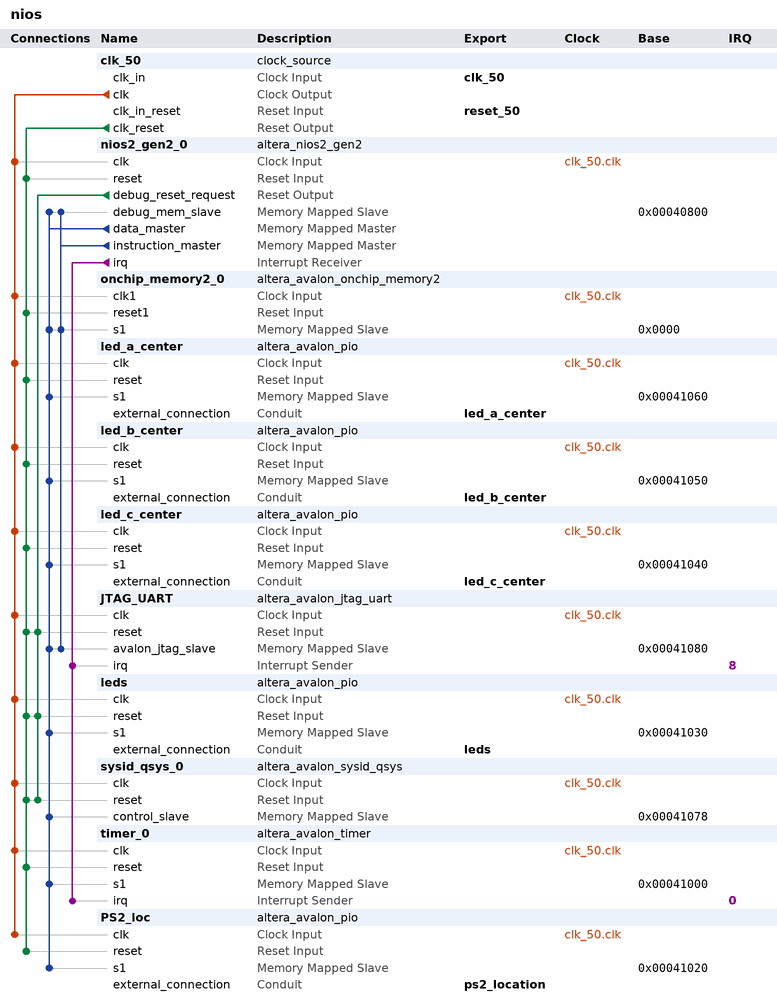
[diagram p0: system contents]
# Platform Designer (Qsys) system nios, Cyclone IV E EP4CE115F29C7
# Parameters at their usual value, and those the tool derives, are not listed.
package require -exact qsys 16.1
create_system nios
set_project_property DEVICE_FAMILY {Cyclone IV E}
set_project_property DEVICE EP4CE115F29C7

add_instance clk_50 clock_source 16.1
set_instance_parameter_value clk_50 clockFrequency 50000000

add_instance nios2_gen2_0 altera_nios2_gen2 16.1
set_instance_parameter_value nios2_gen2_0 dcache_size 2048
set_instance_parameter_value nios2_gen2_0 exceptionSlave onchip_memory2_0.s1
set_instance_parameter_value nios2_gen2_0 icache_size 4096
set_instance_parameter_value nios2_gen2_0 impl Tiny
set_instance_parameter_value nios2_gen2_0 resetSlave onchip_memory2_0.s1

add_instance onchip_memory2_0 altera_avalon_onchip_memory2 16.1
set_instance_parameter_value onchip_memory2_0 blockType M9K
set_instance_parameter_value onchip_memory2_0 dataWidth 32
set_instance_parameter_value onchip_memory2_0 dualPort false
set_instance_parameter_value onchip_memory2_0 initMemContent false
set_instance_parameter_value onchip_memory2_0 initializationFileName onchip_mem.hex
set_instance_parameter_value onchip_memory2_0 memorySize 200000

add_instance led_a_center altera_avalon_pio 16.1
set_instance_parameter_value led_a_center direction Input
set_instance_parameter_value led_a_center width 17

add_instance led_b_center altera_avalon_pio 16.1
set_instance_parameter_value led_b_center direction Input
set_instance_parameter_value led_b_center width 17

add_instance led_c_center altera_avalon_pio 16.1
set_instance_parameter_value led_c_center direction Input
set_instance_parameter_value led_c_center width 17

add_instance JTAG_UART altera_avalon_jtag_uart 16.1
set_instance_parameter_value JTAG_UART simInteractiveOptions NO_INTERACTIVE_WINDOWS

add_instance leds altera_avalon_pio 16.1
set_instance_parameter_value leds direction Output
set_instance_parameter_value leds width 17

add_instance sysid_qsys_0 altera_avalon_sysid_qsys 16.1
set_instance_parameter_value sysid_qsys_0 id 0

add_instance timer_0 altera_avalon_timer 16.1
set_instance_parameter_value timer_0 alwaysRun true
set_instance_parameter_value timer_0 fixedPeriod true
set_instance_parameter_value timer_0 period 10
set_instance_parameter_value timer_0 periodUnits MSEC
set_instance_parameter_value timer_0 snapshot false

add_instance PS2_loc altera_avalon_pio 16.1
set_instance_parameter_value PS2_loc direction Output
set_instance_parameter_value PS2_loc width 5

# connections
add_connection clk_50.clk JTAG_UART.clk clock
add_connection clk_50.clk led_a_center.clk clock
add_connection clk_50.clk led_b_center.clk clock
add_connection clk_50.clk led_c_center.clk clock
add_connection clk_50.clk leds.clk clock
add_connection clk_50.clk nios2_gen2_0.clk clock
add_connection clk_50.clk onchip_memory2_0.clk1 clock
add_connection clk_50.clk PS2_loc.clk clock
add_connection clk_50.clk sysid_qsys_0.clk clock
add_connection clk_50.clk timer_0.clk clock
add_connection clk_50.clk_reset JTAG_UART.reset reset
add_connection clk_50.clk_reset led_a_center.reset reset
add_connection clk_50.clk_reset led_b_center.reset reset
add_connection clk_50.clk_reset led_c_center.reset reset
add_connection clk_50.clk_reset leds.reset reset
add_connection clk_50.clk_reset nios2_gen2_0.reset reset
add_connection clk_50.clk_reset onchip_memory2_0.reset1 reset
add_connection clk_50.clk_reset PS2_loc.reset reset
add_connection clk_50.clk_reset sysid_qsys_0.reset reset
add_connection clk_50.clk_reset timer_0.reset reset
add_connection nios2_gen2_0.debug_reset_request JTAG_UART.reset reset
add_connection nios2_gen2_0.debug_reset_request leds.reset reset
add_connection nios2_gen2_0.debug_reset_request sysid_qsys_0.reset reset
add_connection nios2_gen2_0.data_master JTAG_UART.avalon_jtag_slave avalon
set_connection_parameter_value nios2_gen2_0.data_master/JTAG_UART.avalon_jtag_slave baseAddress 0x00041080
add_connection nios2_gen2_0.data_master led_a_center.s1 avalon
set_connection_parameter_value nios2_gen2_0.data_master/led_a_center.s1 baseAddress 0x00041060
add_connection nios2_gen2_0.data_master led_b_center.s1 avalon
set_connection_parameter_value nios2_gen2_0.data_master/led_b_center.s1 baseAddress 0x00041050
add_connection nios2_gen2_0.data_master led_c_center.s1 avalon
set_connection_parameter_value nios2_gen2_0.data_master/led_c_center.s1 baseAddress 0x00041040
add_connection nios2_gen2_0.data_master leds.s1 avalon
set_connection_parameter_value nios2_gen2_0.data_master/leds.s1 baseAddress 0x00041030
add_connection nios2_gen2_0.data_master nios2_gen2_0.debug_mem_slave avalon
set_connection_parameter_value nios2_gen2_0.data_master/nios2_gen2_0.debug_mem_slave baseAddress 0x00040800
add_connection nios2_gen2_0.data_master onchip_memory2_0.s1 avalon
set_connection_parameter_value nios2_gen2_0.data_master/onchip_memory2_0.s1 baseAddress 0x0000
add_connection nios2_gen2_0.data_master PS2_loc.s1 avalon
set_connection_parameter_value nios2_gen2_0.data_master/PS2_loc.s1 baseAddress 0x00041020
add_connection nios2_gen2_0.data_master sysid_qsys_0.control_slave avalon
set_connection_parameter_value nios2_gen2_0.data_master/sysid_qsys_0.control_slave baseAddress 0x00041078
add_connection nios2_gen2_0.data_master timer_0.s1 avalon
set_connection_parameter_value nios2_gen2_0.data_master/timer_0.s1 baseAddress 0x00041000
add_connection nios2_gen2_0.instruction_master JTAG_UART.avalon_jtag_slave avalon
set_connection_parameter_value nios2_gen2_0.instruction_master/JTAG_UART.avalon_jtag_slave baseAddress 0x00041080
add_connection nios2_gen2_0.instruction_master nios2_gen2_0.debug_mem_slave avalon
set_connection_parameter_value nios2_gen2_0.instruction_master/nios2_gen2_0.debug_mem_slave baseAddress 0x00040800
add_connection nios2_gen2_0.instruction_master onchip_memory2_0.s1 avalon
set_connection_parameter_value nios2_gen2_0.instruction_master/onchip_memory2_0.s1 baseAddress 0x0000
add_connection nios2_gen2_0.irq JTAG_UART.irq interrupt
set_connection_parameter_value nios2_gen2_0.irq/JTAG_UART.irq irqNumber 8
add_connection nios2_gen2_0.irq timer_0.irq interrupt
set_connection_parameter_value nios2_gen2_0.irq/timer_0.irq irqNumber 0

# exported interfaces
add_interface clk_50 clock sink
set_interface_property clk_50 EXPORT_OF clk_50.clk_in
add_interface led_a_center conduit end
set_interface_property led_a_center EXPORT_OF led_a_center.external_connection
add_interface led_b_center conduit end
set_interface_property led_b_center EXPORT_OF led_b_center.external_connection
add_interface led_c_center conduit end
set_interface_property led_c_center EXPORT_OF led_c_center.external_connection
add_interface leds conduit end
set_interface_property leds EXPORT_OF leds.external_connection
add_interface ps2_location conduit end
set_interface_property ps2_location EXPORT_OF PS2_loc.external_connection
add_interface reset_50 reset sink
set_interface_property reset_50 EXPORT_OF clk_50.clk_in_reset

set_interconnect_requirement {$system} qsys_mm.clockCrossingAdapter HANDSHAKE
set_interconnect_requirement {$system} qsys_mm.enableEccProtection FALSE
set_interconnect_requirement {$system} qsys_mm.insertDefaultSlave FALSE
set_interconnect_requirement {$system} qsys_mm.maxAdditionalLatency 1

save_system nios.qsys
